# EAGLE schematic mt15_pla (EAGLE 6.6.0), part 2 of 2
## Sheet 8 of 9
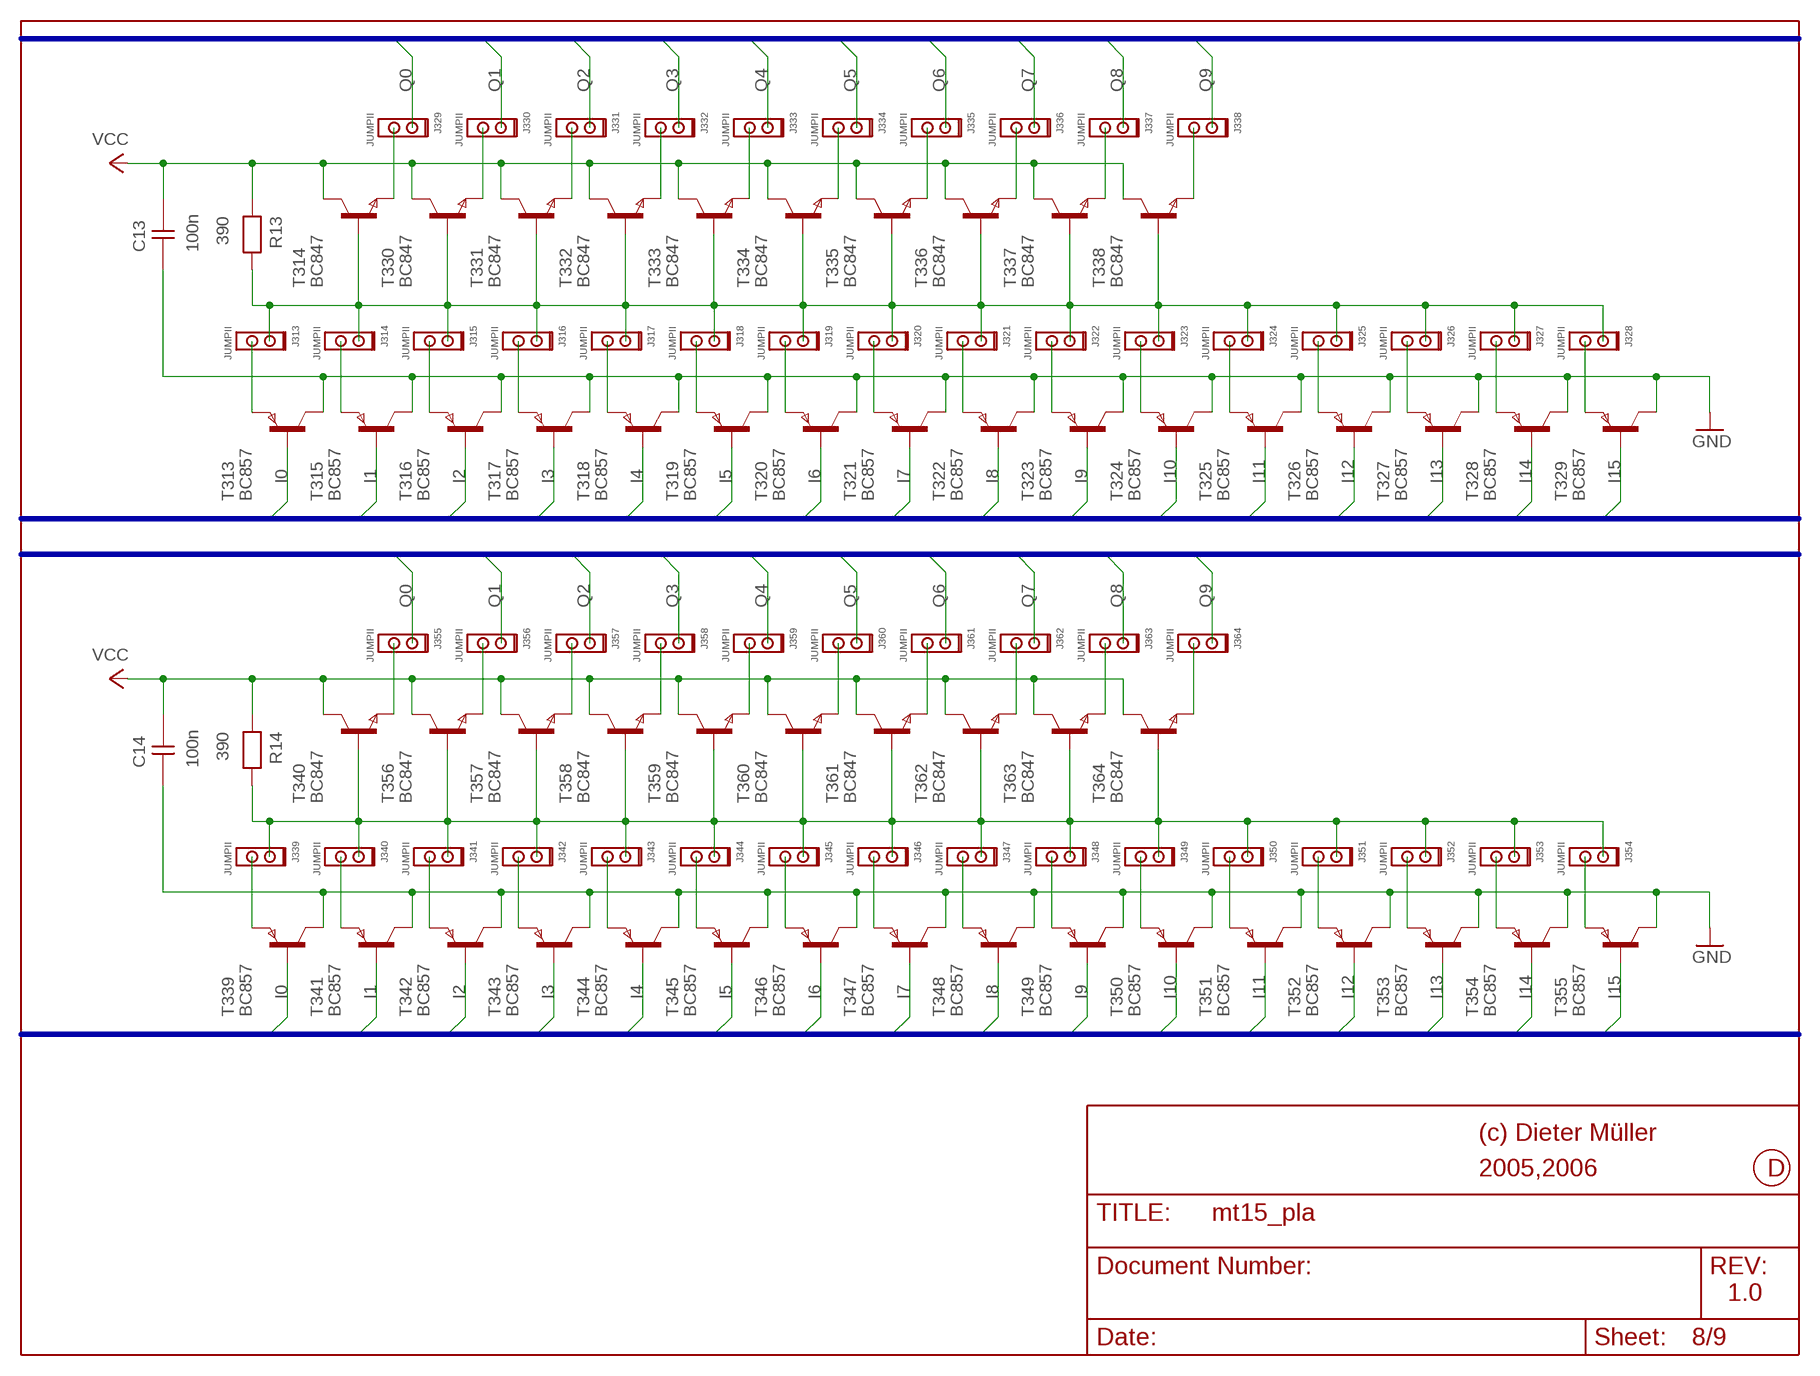
[diagram p7: schematic, sheet 8]

### Parts
C13  100n  CAPNP-5  [0204]
C14  100n  CAPNP-5  [0204]
J313  JUMPII  JUMPII@2  [JUMPII]
J314  JUMPII  JUMPII@2  [JUMPII]
J315  JUMPII  JUMPII@2  [JUMPII]
J316  JUMPII  JUMPII@2  [JUMPII]
J317  JUMPII  JUMPII@2  [JUMPII]
J318  JUMPII  JUMPII@2  [JUMPII]
J319  JUMPII  JUMPII@2  [JUMPII]
J320  JUMPII  JUMPII@2  [JUMPII]
J321  JUMPII  JUMPII@2  [JUMPII]
J322  JUMPII  JUMPII@2  [JUMPII]
J323  JUMPII  JUMPII@2  [JUMPII]
J324  JUMPII  JUMPII@2  [JUMPII]
J325  JUMPII  JUMPII@2  [JUMPII]
J326  JUMPII  JUMPII@2  [JUMPII]
J327  JUMPII  JUMPII@2  [JUMPII]
J328  JUMPII  JUMPII@2  [JUMPII]
J329  JUMPII  JUMPII@2  [JUMPII]
J330  JUMPII  JUMPII@2  [JUMPII]
J331  JUMPII  JUMPII@2  [JUMPII]
J332  JUMPII  JUMPII@2  [JUMPII]
J333  JUMPII  JUMPII@2  [JUMPII]
J334  JUMPII  JUMPII@2  [JUMPII]
J335  JUMPII  JUMPII@2  [JUMPII]
J336  JUMPII  JUMPII@2  [JUMPII]
J337  JUMPII  JUMPII@2  [JUMPII]
J338  JUMPII  JUMPII@2  [JUMPII]
J339  JUMPII  JUMPII@2  [JUMPII]
J340  JUMPII  JUMPII@2  [JUMPII]
J341  JUMPII  JUMPII@2  [JUMPII]
J342  JUMPII  JUMPII@2  [JUMPII]
J343  JUMPII  JUMPII@2  [JUMPII]
J344  JUMPII  JUMPII@2  [JUMPII]
J345  JUMPII  JUMPII@2  [JUMPII]
J346  JUMPII  JUMPII@2  [JUMPII]
J347  JUMPII  JUMPII@2  [JUMPII]
J348  JUMPII  JUMPII@2  [JUMPII]
J349  JUMPII  JUMPII@2  [JUMPII]
J350  JUMPII  JUMPII@2  [JUMPII]
J351  JUMPII  JUMPII@2  [JUMPII]
J352  JUMPII  JUMPII@2  [JUMPII]
J353  JUMPII  JUMPII@2  [JUMPII]
J354  JUMPII  JUMPII@2  [JUMPII]
J355  JUMPII  JUMPII@2  [JUMPII]
J356  JUMPII  JUMPII@2  [JUMPII]
J357  JUMPII  JUMPII@2  [JUMPII]
J358  JUMPII  JUMPII@2  [JUMPII]
J359  JUMPII  JUMPII@2  [JUMPII]
J360  JUMPII  JUMPII@2  [JUMPII]
J361  JUMPII  JUMPII@2  [JUMPII]
J362  JUMPII  JUMPII@2  [JUMPII]
J363  JUMPII  JUMPII@2  [JUMPII]
J364  JUMPII  JUMPII@2  [JUMPII]
R13  390  RESEU-7,5  [0204]
R14  390  RESEU-7,5  [0204]
T313  BC857  BC557  [SOT-23]
T314  BC847  BC547  [SOT-23]
T315  BC857  BC557  [SOT-23]
T316  BC857  BC557  [SOT-23]
T317  BC857  BC557  [SOT-23]
T318  BC857  BC557  [SOT-23]
T319  BC857  BC557  [SOT-23]
T320  BC857  BC557  [SOT-23]
T321  BC857  BC557  [SOT-23]
T322  BC857  BC557  [SOT-23]
T323  BC857  BC557  [SOT-23]
T324  BC857  BC557  [SOT-23]
T325  BC857  BC557  [SOT-23]
T326  BC857  BC557  [SOT-23]
T327  BC857  BC557  [SOT-23]
T328  BC857  BC557  [SOT-23]
T329  BC857  BC557  [SOT-23]
T330  BC847  BC547  [SOT-23]
T331  BC847  BC547  [SOT-23]
T332  BC847  BC547  [SOT-23]
T333  BC847  BC547  [SOT-23]
T334  BC847  BC547  [SOT-23]
T335  BC847  BC547  [SOT-23]
T336  BC847  BC547  [SOT-23]
T337  BC847  BC547  [SOT-23]
T338  BC847  BC547  [SOT-23]
T339  BC857  BC557  [SOT-23]
T340  BC847  BC547  [SOT-23]
T341  BC857  BC557  [SOT-23]
T342  BC857  BC557  [SOT-23]
T343  BC857  BC557  [SOT-23]
T344  BC857  BC557  [SOT-23]
T345  BC857  BC557  [SOT-23]
T346  BC857  BC557  [SOT-23]
T347  BC857  BC557  [SOT-23]
T348  BC857  BC557  [SOT-23]
T349  BC857  BC557  [SOT-23]
T350  BC857  BC557  [SOT-23]
T351  BC857  BC557  [SOT-23]
T352  BC857  BC557  [SOT-23]
T353  BC857  BC557  [SOT-23]
T354  BC857  BC557  [SOT-23]
T355  BC857  BC557  [SOT-23]
T356  BC847  BC547  [SOT-23]
T357  BC847  BC547  [SOT-23]
T358  BC847  BC547  [SOT-23]
T359  BC847  BC547  [SOT-23]
T360  BC847  BC547  [SOT-23]
T361  BC847  BC547  [SOT-23]
T362  BC847  BC547  [SOT-23]
T363  BC847  BC547  [SOT-23]
T364  BC847  BC547  [SOT-23]

### Nets
GND: C13.1 C14.1 T313.3(C) T315.3(C) T316.3(C) T317.3(C) T318.3(C) T319.3(C) T320.3(C) T321.3(C) T322.3(C) T323.3(C) T324.3(C) T325.3(C) T326.3(C) T327.3(C) T328.3(C) T329.3(C) T339.3(C) T341.3(C) T342.3(C) T343.3(C) T344.3(C) T345.3(C) T346.3(C) T347.3(C) T348.3(C) T349.3(C) T350.3(C) T351.3(C) T352.3(C) T353.3(C) T354.3(C) T355.3(C) ; also sheet 1,2,3,4,5,6,7,9
I0: T313.2(B) T339.2(B) ; also sheet 2,3,4,5,6,7,9
I1: T315.2(B) T341.2(B) ; also sheet 2,3,4,5,6,7,9
I2: T316.2(B) T342.2(B) ; also sheet 2,3,4,5,6,7,9
I3: T317.2(B) T343.2(B) ; also sheet 2,3,4,5,6,7,9
I4: T318.2(B) T344.2(B) ; also sheet 2,3,4,5,6,7,9
I5: T319.2(B) T345.2(B) ; also sheet 2,3,4,5,6,7,9
I6: T320.2(B) T346.2(B) ; also sheet 2,3,4,5,6,7,9
I7: T321.2(B) T347.2(B) ; also sheet 2,3,4,5,6,7,9
I8: T322.2(B) T348.2(B) ; also sheet 2,3,4,5,6,7,9
I9: T323.2(B) T349.2(B) ; also sheet 2,3,4,5,6,7,9
I10: T324.2(B) T350.2(B) ; also sheet 2,3,4,5,6,7,9
I11: T325.2(B) T351.2(B) ; also sheet 2,3,4,5,6,7,9
I12: T326.2(B) T352.2(B) ; also sheet 2,3,4,5,6,7,9
I13: T327.2(B) T353.2(B) ; also sheet 2,3,4,5,6,7,9
I14: T328.2(B) T354.2(B) ; also sheet 2,3,4,5,6,7,9
I15: T329.2(B) T355.2(B) ; also sheet 2,3,4,5,6,7,9
N$325: J313.2 T313.1(E)
N$326: J314.2 T315.1(E)
N$327: J315.2 T316.1(E)
N$328: J313.1 J314.1 J315.1 J316.1 J317.1 J318.1 J319.1 J320.1 J321.1 J322.1 J323.1 J324.1 J325.1 J326.1 J327.1 J328.1 R13.2 T314.2(B) T330.2(B) T331.2(B) T332.2(B) T333.2(B) T334.2(B) T335.2(B) T336.2(B) T337.2(B) T338.2(B)
N$329: J328.2 T329.1(E)
N$330: J327.2 T328.1(E)
N$331: J326.2 T327.1(E)
N$332: J325.2 T326.1(E)
N$333: J324.2 T325.1(E)
N$334: J318.2 T319.1(E)
N$335: J317.2 T318.1(E)
N$336: J316.2 T317.1(E)
N$337: J319.2 T320.1(E)
N$338: J320.2 T321.1(E)
N$339: J321.2 T322.1(E)
N$340: J322.2 T323.1(E)
N$341: J323.2 T324.1(E)
N$342: J338.2 T338.1(E)
N$343: J329.2 T314.1(E)
N$344: J330.2 T330.1(E)
N$345: J331.2 T331.1(E)
N$346: J332.2 T332.1(E)
N$347: J333.2 T333.1(E)
N$348: J334.2 T334.1(E)
N$349: J335.2 T335.1(E)
N$350: J336.2 T336.1(E)
N$351: J337.2 T337.1(E)
N$352: J339.2 T339.1(E)
N$353: J340.2 T341.1(E)
N$354: J341.2 T342.1(E)
N$355: J339.1 J340.1 J341.1 J342.1 J343.1 J344.1 J345.1 J346.1 J347.1 J348.1 J349.1 J350.1 J351.1 J352.1 J353.1 J354.1 R14.2 T340.2(B) T356.2(B) T357.2(B) T358.2(B) T359.2(B) T360.2(B) T361.2(B) T362.2(B) T363.2(B) T364.2(B)
N$356: J354.2 T355.1(E)
N$357: J353.2 T354.1(E)
N$358: J352.2 T353.1(E)
N$359: J351.2 T352.1(E)
N$360: J350.2 T351.1(E)
N$361: J344.2 T345.1(E)
N$362: J343.2 T344.1(E)
N$363: J342.2 T343.1(E)
N$364: J345.2 T346.1(E)
N$365: J346.2 T347.1(E)
N$366: J347.2 T348.1(E)
N$367: J348.2 T349.1(E)
N$368: J349.2 T350.1(E)
N$369: J364.2 T364.1(E)
N$370: J355.2 T340.1(E)
N$371: J356.2 T356.1(E)
N$372: J357.2 T357.1(E)
N$373: J358.2 T358.1(E)
N$374: J359.2 T359.1(E)
N$375: J360.2 T360.1(E)
N$376: J361.2 T361.1(E)
N$377: J362.2 T362.1(E)
N$378: J363.2 T363.1(E)
Q0: J329.1 J355.1 ; also sheet 2,3,4,5,6,7,9
Q1: J330.1 J356.1 ; also sheet 2,3,4,5,6,7,9
Q2: J331.1 J357.1 ; also sheet 2,3,4,5,6,7,9
Q3: J332.1 J358.1 ; also sheet 2,3,4,5,6,7,9
Q4: J333.1 J359.1 ; also sheet 2,3,4,5,6,7,9
Q5: J334.1 J360.1 ; also sheet 2,3,4,5,6,7,9
Q6: J335.1 J361.1 ; also sheet 2,3,4,5,6,7,9
Q7: J336.1 J362.1 ; also sheet 2,3,4,5,6,7,9
Q8: J337.1 J363.1 ; also sheet 2,3,4,5,6,7,9
Q9: J338.1 J364.1 ; also sheet 2,3,4,5,6,7,9
VCC: C13.2 C14.2 R13.1 R14.1 T314.3(C) T330.3(C) T331.3(C) T332.3(C) T333.3(C) T334.3(C) T335.3(C) T336.3(C) T337.3(C) T338.3(C) T340.3(C) T356.3(C) T357.3(C) T358.3(C) T359.3(C) T360.3(C) T361.3(C) T362.3(C) T363.3(C) T364.3(C) ; also sheet 1,2,3,4,5,6,7,9

### Buses
B$1
B$3

### Notes on the sheet
- (c) Dieter Müller
- 2005,2006 | D
- 1.0

## Sheet 9 of 9
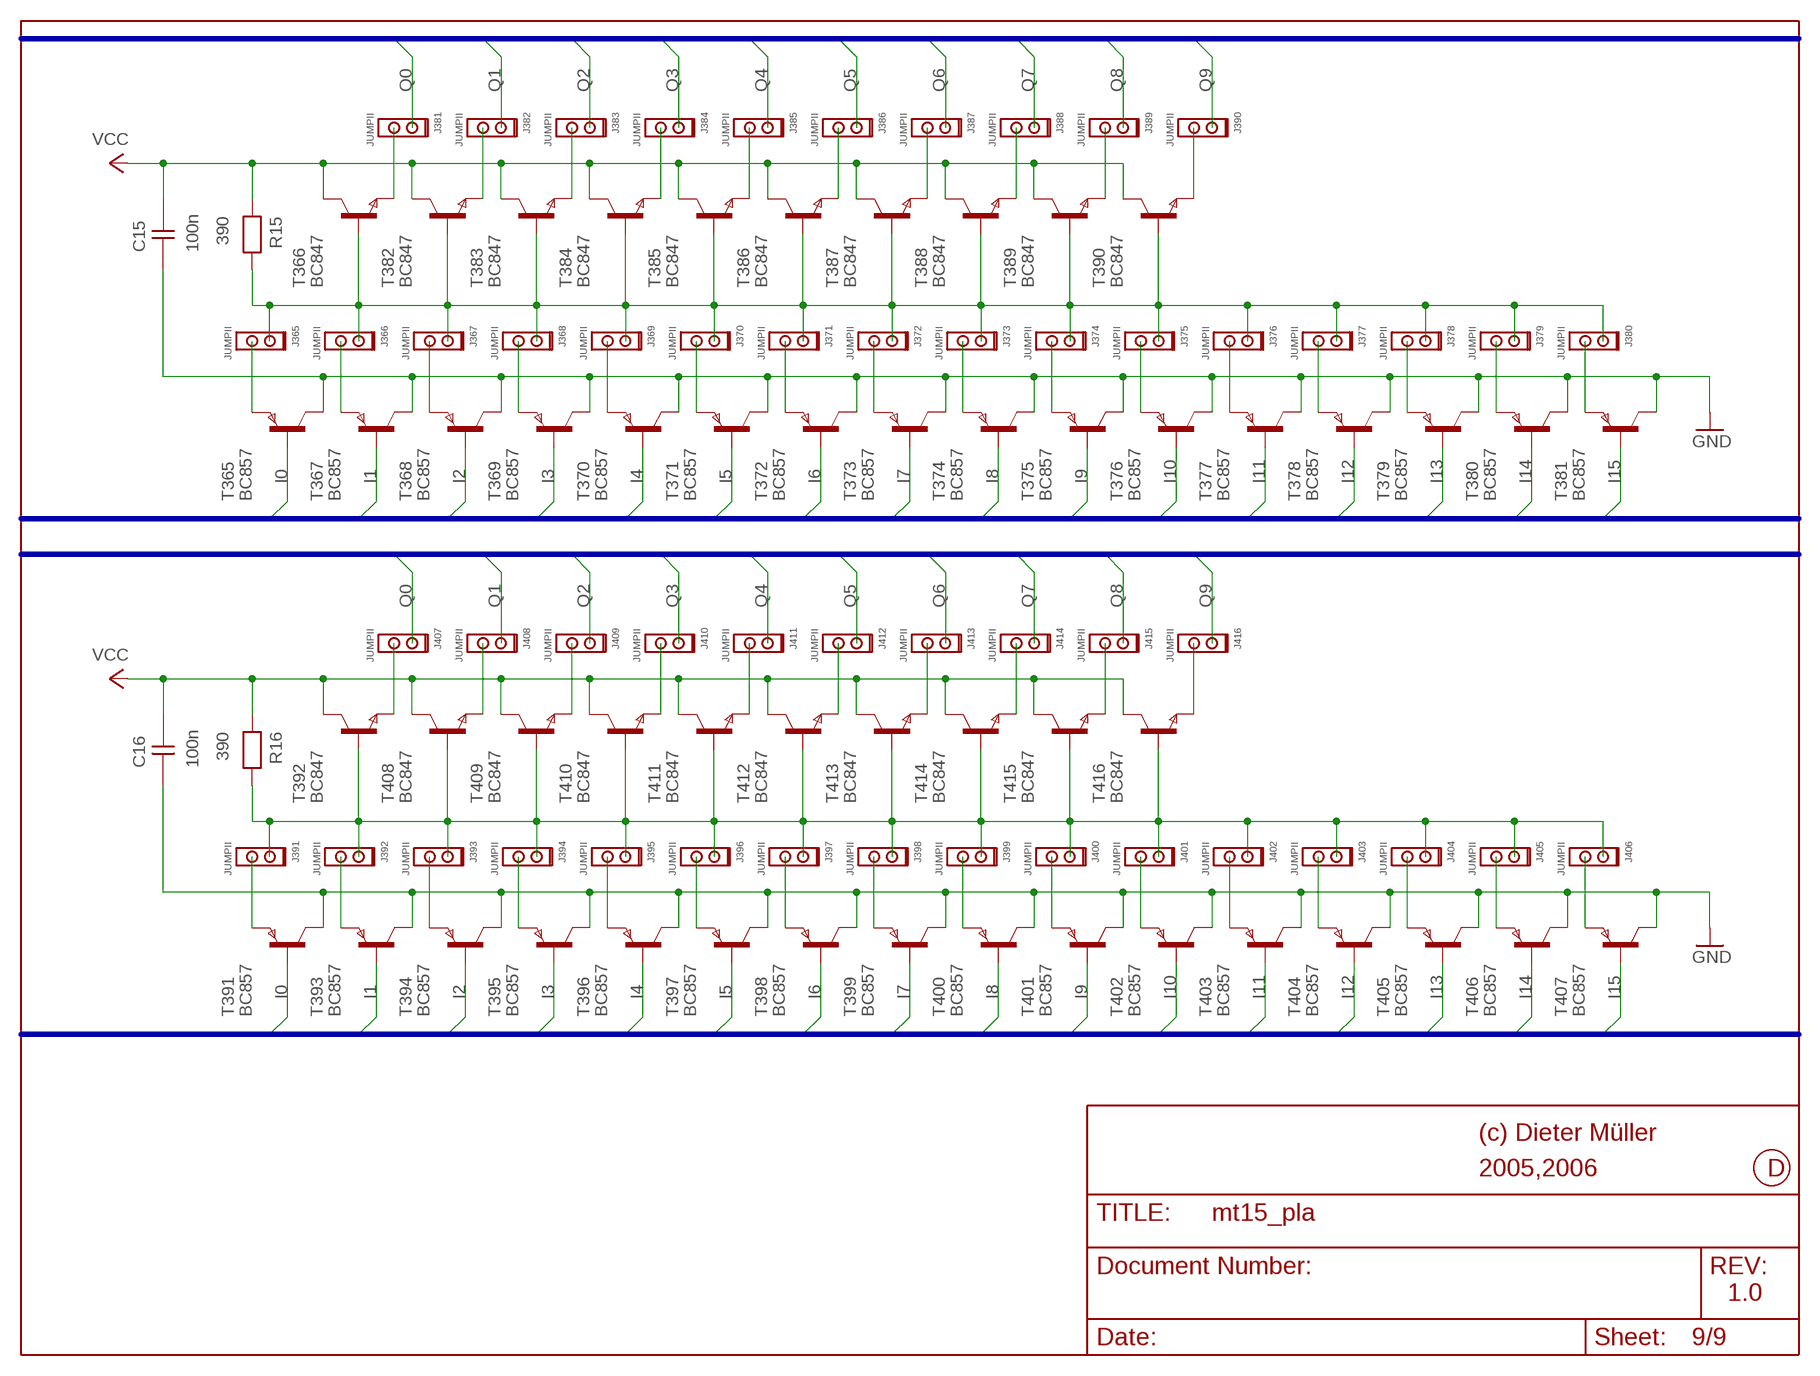
[diagram p8: schematic, sheet 9]

### Parts
C15  100n  CAPNP-5  [0204]
C16  100n  CAPNP-5  [0204]
J365  JUMPII  JUMPII@2  [JUMPII]
J366  JUMPII  JUMPII@2  [JUMPII]
J367  JUMPII  JUMPII@2  [JUMPII]
J368  JUMPII  JUMPII@2  [JUMPII]
J369  JUMPII  JUMPII@2  [JUMPII]
J370  JUMPII  JUMPII@2  [JUMPII]
J371  JUMPII  JUMPII@2  [JUMPII]
J372  JUMPII  JUMPII@2  [JUMPII]
J373  JUMPII  JUMPII@2  [JUMPII]
J374  JUMPII  JUMPII@2  [JUMPII]
J375  JUMPII  JUMPII@2  [JUMPII]
J376  JUMPII  JUMPII@2  [JUMPII]
J377  JUMPII  JUMPII@2  [JUMPII]
J378  JUMPII  JUMPII@2  [JUMPII]
J379  JUMPII  JUMPII@2  [JUMPII]
J380  JUMPII  JUMPII@2  [JUMPII]
J381  JUMPII  JUMPII@2  [JUMPII]
J382  JUMPII  JUMPII@2  [JUMPII]
J383  JUMPII  JUMPII@2  [JUMPII]
J384  JUMPII  JUMPII@2  [JUMPII]
J385  JUMPII  JUMPII@2  [JUMPII]
J386  JUMPII  JUMPII@2  [JUMPII]
J387  JUMPII  JUMPII@2  [JUMPII]
J388  JUMPII  JUMPII@2  [JUMPII]
J389  JUMPII  JUMPII@2  [JUMPII]
J390  JUMPII  JUMPII@2  [JUMPII]
J391  JUMPII  JUMPII@2  [JUMPII]
J392  JUMPII  JUMPII@2  [JUMPII]
J393  JUMPII  JUMPII@2  [JUMPII]
J394  JUMPII  JUMPII@2  [JUMPII]
J395  JUMPII  JUMPII@2  [JUMPII]
J396  JUMPII  JUMPII@2  [JUMPII]
J397  JUMPII  JUMPII@2  [JUMPII]
J398  JUMPII  JUMPII@2  [JUMPII]
J399  JUMPII  JUMPII@2  [JUMPII]
J400  JUMPII  JUMPII@2  [JUMPII]
J401  JUMPII  JUMPII@2  [JUMPII]
J402  JUMPII  JUMPII@2  [JUMPII]
J403  JUMPII  JUMPII@2  [JUMPII]
J404  JUMPII  JUMPII@2  [JUMPII]
J405  JUMPII  JUMPII@2  [JUMPII]
J406  JUMPII  JUMPII@2  [JUMPII]
J407  JUMPII  JUMPII@2  [JUMPII]
J408  JUMPII  JUMPII@2  [JUMPII]
J409  JUMPII  JUMPII@2  [JUMPII]
J410  JUMPII  JUMPII@2  [JUMPII]
J411  JUMPII  JUMPII@2  [JUMPII]
J412  JUMPII  JUMPII@2  [JUMPII]
J413  JUMPII  JUMPII@2  [JUMPII]
J414  JUMPII  JUMPII@2  [JUMPII]
J415  JUMPII  JUMPII@2  [JUMPII]
J416  JUMPII  JUMPII@2  [JUMPII]
R15  390  RESEU-7,5  [0204]
R16  390  RESEU-7,5  [0204]
T365  BC857  BC557  [SOT-23]
T366  BC847  BC547  [SOT-23]
T367  BC857  BC557  [SOT-23]
T368  BC857  BC557  [SOT-23]
T369  BC857  BC557  [SOT-23]
T370  BC857  BC557  [SOT-23]
T371  BC857  BC557  [SOT-23]
T372  BC857  BC557  [SOT-23]
T373  BC857  BC557  [SOT-23]
T374  BC857  BC557  [SOT-23]
T375  BC857  BC557  [SOT-23]
T376  BC857  BC557  [SOT-23]
T377  BC857  BC557  [SOT-23]
T378  BC857  BC557  [SOT-23]
T379  BC857  BC557  [SOT-23]
T380  BC857  BC557  [SOT-23]
T381  BC857  BC557  [SOT-23]
T382  BC847  BC547  [SOT-23]
T383  BC847  BC547  [SOT-23]
T384  BC847  BC547  [SOT-23]
T385  BC847  BC547  [SOT-23]
T386  BC847  BC547  [SOT-23]
T387  BC847  BC547  [SOT-23]
T388  BC847  BC547  [SOT-23]
T389  BC847  BC547  [SOT-23]
T390  BC847  BC547  [SOT-23]
T391  BC857  BC557  [SOT-23]
T392  BC847  BC547  [SOT-23]
T393  BC857  BC557  [SOT-23]
T394  BC857  BC557  [SOT-23]
T395  BC857  BC557  [SOT-23]
T396  BC857  BC557  [SOT-23]
T397  BC857  BC557  [SOT-23]
T398  BC857  BC557  [SOT-23]
T399  BC857  BC557  [SOT-23]
T400  BC857  BC557  [SOT-23]
T401  BC857  BC557  [SOT-23]
T402  BC857  BC557  [SOT-23]
T403  BC857  BC557  [SOT-23]
T404  BC857  BC557  [SOT-23]
T405  BC857  BC557  [SOT-23]
T406  BC857  BC557  [SOT-23]
T407  BC857  BC557  [SOT-23]
T408  BC847  BC547  [SOT-23]
T409  BC847  BC547  [SOT-23]
T410  BC847  BC547  [SOT-23]
T411  BC847  BC547  [SOT-23]
T412  BC847  BC547  [SOT-23]
T413  BC847  BC547  [SOT-23]
T414  BC847  BC547  [SOT-23]
T415  BC847  BC547  [SOT-23]
T416  BC847  BC547  [SOT-23]

### Nets
GND: C15.1 C16.1 T365.3(C) T367.3(C) T368.3(C) T369.3(C) T370.3(C) T371.3(C) T372.3(C) T373.3(C) T374.3(C) T375.3(C) T376.3(C) T377.3(C) T378.3(C) T379.3(C) T380.3(C) T381.3(C) T391.3(C) T393.3(C) T394.3(C) T395.3(C) T396.3(C) T397.3(C) T398.3(C) T399.3(C) T400.3(C) T401.3(C) T402.3(C) T403.3(C) T404.3(C) T405.3(C) T406.3(C) T407.3(C) ; also sheet 1,2,3,4,5,6,7,8
I0: T365.2(B) T391.2(B) ; also sheet 2,3,4,5,6,7,8
I1: T367.2(B) T393.2(B) ; also sheet 2,3,4,5,6,7,8
I2: T368.2(B) T394.2(B) ; also sheet 2,3,4,5,6,7,8
I3: T369.2(B) T395.2(B) ; also sheet 2,3,4,5,6,7,8
I4: T370.2(B) T396.2(B) ; also sheet 2,3,4,5,6,7,8
I5: T371.2(B) T397.2(B) ; also sheet 2,3,4,5,6,7,8
I6: T372.2(B) T398.2(B) ; also sheet 2,3,4,5,6,7,8
I7: T373.2(B) T399.2(B) ; also sheet 2,3,4,5,6,7,8
I8: T374.2(B) T400.2(B) ; also sheet 2,3,4,5,6,7,8
I9: T375.2(B) T401.2(B) ; also sheet 2,3,4,5,6,7,8
I10: T376.2(B) T402.2(B) ; also sheet 2,3,4,5,6,7,8
I11: T377.2(B) T403.2(B) ; also sheet 2,3,4,5,6,7,8
I12: T378.2(B) T404.2(B) ; also sheet 2,3,4,5,6,7,8
I13: T379.2(B) T405.2(B) ; also sheet 2,3,4,5,6,7,8
I14: T380.2(B) T406.2(B) ; also sheet 2,3,4,5,6,7,8
I15: T381.2(B) T407.2(B) ; also sheet 2,3,4,5,6,7,8
N$379: J365.2 T365.1(E)
N$380: J366.2 T367.1(E)
N$381: J367.2 T368.1(E)
N$382: J365.1 J366.1 J367.1 J368.1 J369.1 J370.1 J371.1 J372.1 J373.1 J374.1 J375.1 J376.1 J377.1 J378.1 J379.1 J380.1 R15.2 T366.2(B) T382.2(B) T383.2(B) T384.2(B) T385.2(B) T386.2(B) T387.2(B) T388.2(B) T389.2(B) T390.2(B)
N$383: J380.2 T381.1(E)
N$384: J379.2 T380.1(E)
N$385: J378.2 T379.1(E)
N$386: J377.2 T378.1(E)
N$387: J376.2 T377.1(E)
N$388: J370.2 T371.1(E)
N$389: J369.2 T370.1(E)
N$390: J368.2 T369.1(E)
N$391: J371.2 T372.1(E)
N$392: J372.2 T373.1(E)
N$393: J373.2 T374.1(E)
N$394: J374.2 T375.1(E)
N$395: J375.2 T376.1(E)
N$396: J390.2 T390.1(E)
N$397: J381.2 T366.1(E)
N$398: J382.2 T382.1(E)
N$399: J383.2 T383.1(E)
N$400: J384.2 T384.1(E)
N$401: J385.2 T385.1(E)
N$402: J386.2 T386.1(E)
N$403: J387.2 T387.1(E)
N$404: J388.2 T388.1(E)
N$405: J389.2 T389.1(E)
N$406: J391.2 T391.1(E)
N$407: J392.2 T393.1(E)
N$408: J393.2 T394.1(E)
N$409: J391.1 J392.1 J393.1 J394.1 J395.1 J396.1 J397.1 J398.1 J399.1 J400.1 J401.1 J402.1 J403.1 J404.1 J405.1 J406.1 R16.2 T392.2(B) T408.2(B) T409.2(B) T410.2(B) T411.2(B) T412.2(B) T413.2(B) T414.2(B) T415.2(B) T416.2(B)
N$410: J406.2 T407.1(E)
N$411: J405.2 T406.1(E)
N$412: J404.2 T405.1(E)
N$413: J403.2 T404.1(E)
N$414: J402.2 T403.1(E)
N$415: J396.2 T397.1(E)
N$416: J395.2 T396.1(E)
N$417: J394.2 T395.1(E)
N$418: J397.2 T398.1(E)
N$419: J398.2 T399.1(E)
N$420: J399.2 T400.1(E)
N$421: J400.2 T401.1(E)
N$422: J401.2 T402.1(E)
N$423: J416.2 T416.1(E)
N$424: J407.2 T392.1(E)
N$425: J408.2 T408.1(E)
N$426: J409.2 T409.1(E)
N$427: J410.2 T410.1(E)
N$428: J411.2 T411.1(E)
N$429: J412.2 T412.1(E)
N$430: J413.2 T413.1(E)
N$431: J414.2 T414.1(E)
N$432: J415.2 T415.1(E)
Q0: J381.1 J407.1 ; also sheet 2,3,4,5,6,7,8
Q1: J382.1 J408.1 ; also sheet 2,3,4,5,6,7,8
Q2: J383.1 J409.1 ; also sheet 2,3,4,5,6,7,8
Q3: J384.1 J410.1 ; also sheet 2,3,4,5,6,7,8
Q4: J385.1 J411.1 ; also sheet 2,3,4,5,6,7,8
Q5: J386.1 J412.1 ; also sheet 2,3,4,5,6,7,8
Q6: J387.1 J413.1 ; also sheet 2,3,4,5,6,7,8
Q7: J388.1 J414.1 ; also sheet 2,3,4,5,6,7,8
Q8: J389.1 J415.1 ; also sheet 2,3,4,5,6,7,8
Q9: J390.1 J416.1 ; also sheet 2,3,4,5,6,7,8
VCC: C15.2 C16.2 R15.1 R16.1 T366.3(C) T382.3(C) T383.3(C) T384.3(C) T385.3(C) T386.3(C) T387.3(C) T388.3(C) T389.3(C) T390.3(C) T392.3(C) T408.3(C) T409.3(C) T410.3(C) T411.3(C) T412.3(C) T413.3(C) T414.3(C) T415.3(C) T416.3(C) ; also sheet 1,2,3,4,5,6,7,8

### Buses
B$1
B$3

### Notes on the sheet
- (c) Dieter Müller
- 2005,2006 | D
- 1.0

## Library data of the parts
C1-C16 = DISCRETE@2:CAPNP-5
J1-J416 = jg:JUMPII@2
R1-R16 = DISCRETE:RESEU-7,5
T1-T16 T27 T29-T43 T53 T55-T69 T79 T81-T95 T105 T107-T121 T131 T133-T147 T157 T159-T173 T183 T185-T199 T209 T211-T225 T235 T237-T251 T261 T263-T277 T287 T289-T303 T313 T315-T329 T339 T341-T355 T365 T367-T381 T391 T393-T407 = PNP:BC557
T17-T26 T28 T44-T52 T54 T70-T78 T80 T96-T104 T106 T122-T130 T132 T148-T156 T158 T174-T182 T184 T200-T208 T210 T226-T234 T236 T252-T260 T262 T278-T286 T288 T304-T312 T314 T330-T338 T340 T356-T364 T366 T382-T390 T392 T408-T416 = NPN:BC547